# Altium schematic sheet Buffer_Sheet1.SchDoc
size A; SheetNumber: 1; SheetTotal: 1; SPICEModelCacheJFSCXCGO: <root> / <DocumentId>JFSCXCGO</DocumentId> / <CacheFrame Number="0"> / <Model Name="idealopamp_saturating" Kind="CKT"> / <Text>.SUBCKT IdealOpamp_Saturating  In+ In- VCC VEE Out PARAMS: GAIN=1Meg / RVCC VCC 0 350 / RVEE VEE 0 350 / E1 X 0 In+ In- {Gain} / B1 Out 0 V=IF(V(X) &gt; V(VCC), V(VCC), IF(V(X) &lt; V(VEE),V(VEE),V(X))) / R1 In- In+ 1e12 / .ENDS</Text> / </Model> / <Model Name="notsimulated" Kind="CKT"> / <Text>.SUBCKT NOTSIMULATED 1 / .ENDS NOTSIMULATED</Text> / </Model> / </CacheFrame> / </root>
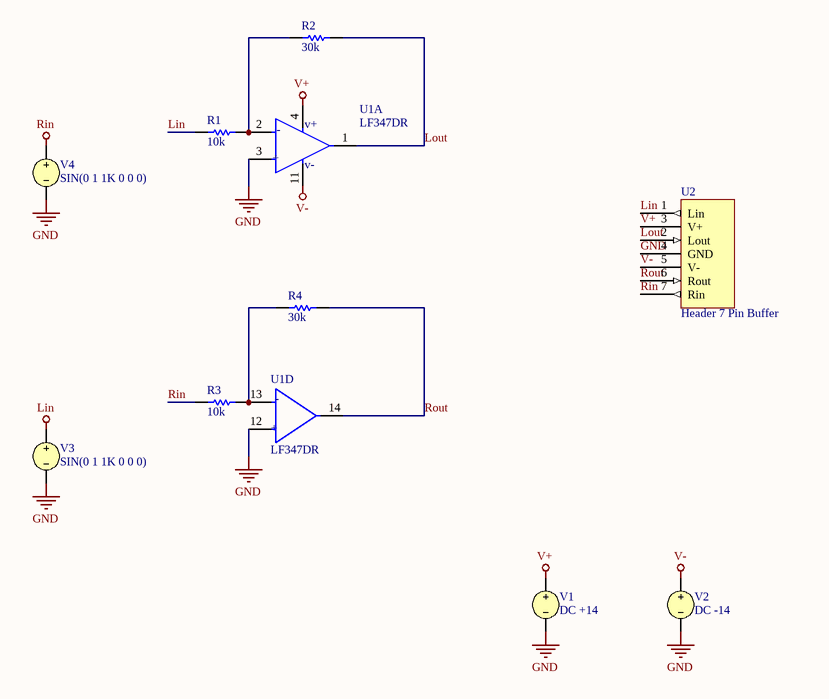
[diagram p0: Buffer_Sheet1.SchDoc]

## Parts
R1  value 10k  [KBS_SMD0603]  (hidden comment: KBS_Resistor)
R2  value 30k  [KBS_SMD0603]  (hidden comment: KBS_Resistor)
R3  value 10k  [KBS_SMD0603]  (hidden comment: KBS_Resistor)
R4  value 30k  [KBS_SMD0603]  (hidden comment: KBS_Resistor)
U1  LF347DR  [KBS_SO14_w_Guide_Pin_Holes]  (parts A,D of 4)
U2  Header 7 Pin Buffer  [KBS_7pin_Header_Buffer]
V1  DC +14
V2  DC -14
V3  SIN(0 1 1K 0 0 0)
V4  SIN(0 1 1K 0 0 0)

## Nets
GND: U1.3(1IN+) U1.12(4IN+) U2.4(GND) V1.2 V2.2 V3.2 V4.2
Lin: R1.1 U2.1(Lin) V3.1
Rin: R3.1 U2.7(Rin) V4.1
V+: U1.4(VCC+) U2.3(V+) V1.1
V-: U1.11(VCC-) U2.5(V-) V2.1
Lout: R2.2 U1.1(1OUT) U2.2(Lout)
Rout: R4.2 U1.14(4OUT) U2.6(Rout)
NetR1_2: R1.2 R2.1 U1.2(1IN-)
NetR3_2: R3.2 R4.1 U1.13(4IN-)

## Notes on the sheet
- (in symbol CMP-014-00002-1, part A) v+; -; +; v-
- (in symbol CMP-014-00002-1, part D) -; +

## Library data of the parts
R1-R4 = CMP-009-00177-1: Fixed Resistor, 0.25W, 10000ohm, 200V, Surface Mount, 1206; Manufacturer: Yageo; Manufacturer Part Number: RC1206FR-0710KL; Tolerance: 1%; Power: 250mW; Pins: 2; RoHS Compliant: Yes; Max Operating Temperature: 155°C; Mounting Technology: Surface Mount; Min Operating Temperature: -55°C; Case/Package: 1206; Component Type: Resistors
U1 = CMP-014-00002-1: Operational Amplifier, 4 Func, 13000uV Offset-Max, JFET, PDSO14; Manufacturer: Texas Instruments; Nominal Supply Voltage: 15V; Channels: 4; Max Operating Temperature: 70°C; Min Operating Temperature: 0°C; RoHS Compliant: Yes; Pins: 14; Case/Package: SOP; Manufacturer Part Number: LF347DR; Component Type: Amplifiers
U2 = CMP-002-00071-2: 7 Pin Header for ECEN 299 buffer PCB.; Component Type: Connectors
V1 V2 = VSRC: Voltage Source; Note: PCB Footprint - Not required; AC Magnitude: 1; AC Phase: 0; Published: 8-Jun-2000; LatestRevisionDate: 17-Jul-2002; LatestRevisionNote: Re-released for DXP Platform.; PackageReference: Not Applicable; Publisher: Altium Limited
  V1: Value: +14
  V2: Value: -14
V3 V4 = VSRC: Voltage Source; Note: PCB Footprint - Not required; AC Magnitude: 1; AC Phase: 0; DC Magnitude: 5; Published: 8-Jun-2000; LatestRevisionDate: 17-Jul-2002; LatestRevisionNote: Re-released for DXP Platform.; PackageReference: Not Applicable; Publisher: Altium Limited; Offset: 0; Amplitude: 1; Frequency: 1K; Delay: 0; Damping Factor: 0; Phase: 0